# Altium project lab3.PrjPcb
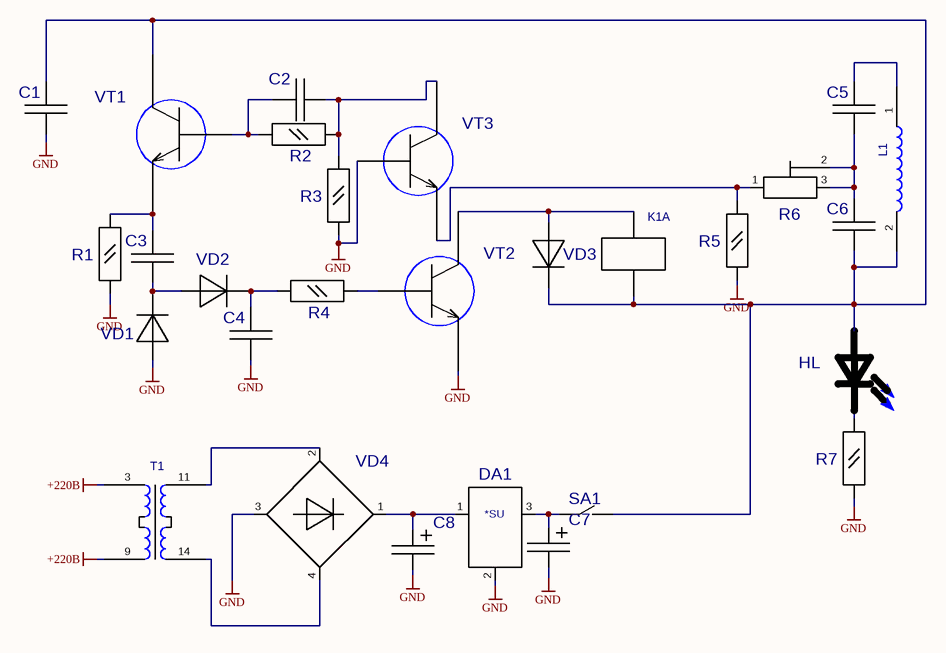
[diagram p0: Sheet1.SCHDOC]
1 sheet, 28 parts. Net scope: global (net labels, ports and power ports of the same name join across sheets).

## Sheet Sheet1.SCHDOC
size 297 x 209 mm; SheetNumber: 1; SheetTotal: 1; DocumentName: Sheet1.SCHDOC

### Parts
C1  B32921-C3103-0,01UF  [B32921(13X4)]  (value not drawn)
C2  B32921-C3103-0,01UF  [B32921(13X4)]  (value not drawn)
C3  B32921-C3103-0,01UF  [B32921(13X4)]  (value not drawn)
C4  B32921-C3103-0,01UF  [B32921(13X4)]  (value not drawn)
C5  B32921-C3103-0,01UF  [B32921(13X4)]  (value not drawn)
C6  B32921-C3103-0,01UF  [B32921(13X4)]  (value not drawn)
C7  COND-PL-EL  [CC-PL-EL1]  (value not drawn)
C8  COND-PL-EL  [CC-PL-EL1]  (value not drawn)
DA1  KR142EN  [KR142EN]  (value not drawn)
HL  КИПД21-К  [LED-5MM]  (value not drawn)
K1  РЭС6  [РЭС6]  (value not drawn)  (part A of 3)
L1  L  [L]  (value not drawn)
R1  C2-33H-0.125W_OLD_UGO  [C2-33H-0.125W]  (value not drawn)
R2  C2-33H-0.125W_OLD_UGO  [C2-33H-0.125W]  (value not drawn)
R3  C2-33H-0.125W_OLD_UGO  [C2-33H-0.125W]  (value not drawn)
R4  C2-33H-0.125W_OLD_UGO  [C2-33H-0.125W]  (value not drawn)
R5  C2-33H-0.125W_OLD_UGO  [C2-33H-0.125W]  (value not drawn)
R6  SP3-19A1  [SP3-19A1]  (value not drawn)
R7  C2-33H-0.125W_OLD_UGO  [C2-33H-0.125W]  (value not drawn)
SA1  8AS9M2RE  [8AS9M2RE]  (value not drawn)
T1  ТПП277  [ТПП]  (value not drawn)
VD1  DO27  [DO27]  (value not drawn)
VD2  DO27  [DO27]  (value not drawn)
VD3  DO27  [DO27]  (value not drawn)
VD4  KBU6A  [KBU6A]  (value not drawn)
VT1  2N4401  [TO-92-1]  (value not drawn)
VT2  2N4401  [TO-92-1]  (value not drawn)
VT3  2N4401  [TO-92-1]  (value not drawn)

### Nets
+220B: T1.3 T1.9
GND: C1.2 C4.2 C7.2(i/o1) C8.2(i/o1) DA1.2(GND0) R1.2 R3.2 R5.2 R7.2 VD1.2(I/O2) VD4.3 VT2.1(E) VT3.2(B)
NetC1_1: C1.1 C6.2 HL.1(A) K1.8 L1.2 SA1.1 VD3.1(I/O1) VT1.3(K)
NetC2_1: C2.1 R2.1 VT1.2(B)
NetC2_2: C2.2 R2.2 R3.1 VT3.3(K)
NetC3_1: C3.1 R1.1 VT1.1(E)
NetC3_2: C3.2 VD1.1(I/O1) VD2.2(I/O2)
NetC4_1: C4.1 R4.1 VD2.1(I/O1)
NetC5_1: C5.1 L1.1
NetC5_2: C5.2 C6.1 R6.2(I/O2) R6.3(I/O3)
NetC7_1: C7.1(i/o) DA1.3(OUT0) SA1.2
NetC8_1: C8.1(i/o) DA1.1(IN0) VD4.1
NetHL_2: HL.2(K) R7.1
NetK1_7: K1.7 VD3.2(I/O2) VT2.3(K)
NetR4_2: R4.2 VT2.2(B)
NetR5_1: R5.1 R6.1(I/O1) VT3.1(E)
NetT1_11: T1.11 VD4.2
NetT1_14: T1.14 VD4.4

### Notes on the sheet
- (in symbol KR142EN) *SU

### Library data of the parts
R1-R5 R7 = C2-33H-0.125W_OLD_UGO: Autor: pcbdesigner.ru; Value: *
R6 = SP3-19A1: PDIF_TY: 11107; Value: *
C1-C6 = B32921-C3103-0,01UF: Value: *
C7 C8 = COND-PL-EL: Value: *
DA1 = KR142EN: Value: *
K1 = РЭС6: Value: *
L1 = L: Value: *
SA1 = 8AS9M2RE: Value: *; Author: pcbdesigner.ru
T1 = ТПП277: Value: *
VD1-VD3 = DO27: Value: *
VD4 = KBU6A: Value: *
VT1-VT3 = 2N4401: Value: *